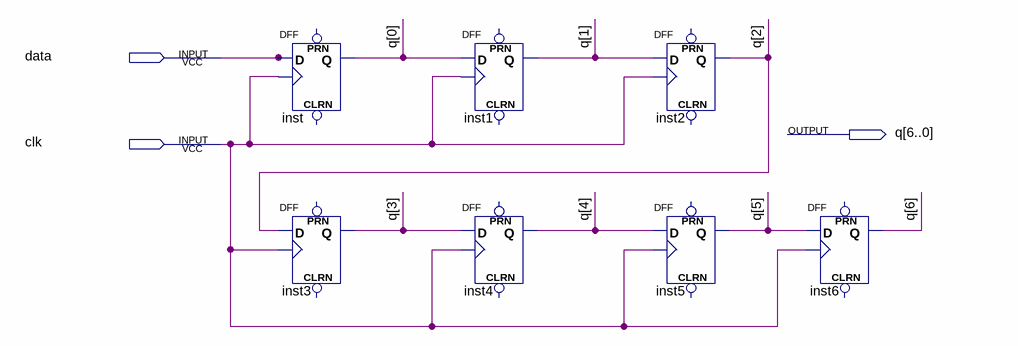
[diagram p0: schematic sheet]
// Quartus schematic lab_102.bdf as structural Verilog: 7 symbols, 3 pins
module lab_102 (
  input  data,
  input  clk,
  output [6:0] q
);

  DFF inst (.CLK(clk), .D(data), .Q(q[0]));  // open: CLRN, PRN
  DFF inst3 (.CLK(clk), .D(q[2]), .Q(q[3]));  // open: CLRN, PRN
  DFF inst1 (.CLK(clk), .D(q[0]), .Q(q[1]));  // open: CLRN, PRN
  DFF inst4 (.CLK(clk), .D(q[3]), .Q(q[4]));  // open: CLRN, PRN
  DFF inst2 (.CLK(clk), .D(q[1]), .Q(q[2]));  // open: CLRN, PRN
  DFF inst5 (.CLK(clk), .D(q[4]), .Q(q[5]));  // open: CLRN, PRN
  DFF inst6 (.CLK(clk), .D(q[5]), .Q(q[6]));  // open: CLRN, PRN
endmodule
